# Altium schematic sheet CompoundPeripheral.SchDoc: Compound Peripheral
size A4; DrawnBy: J.F.B.; Revision: 1; SheetNumber: 1; SheetTotal: 1
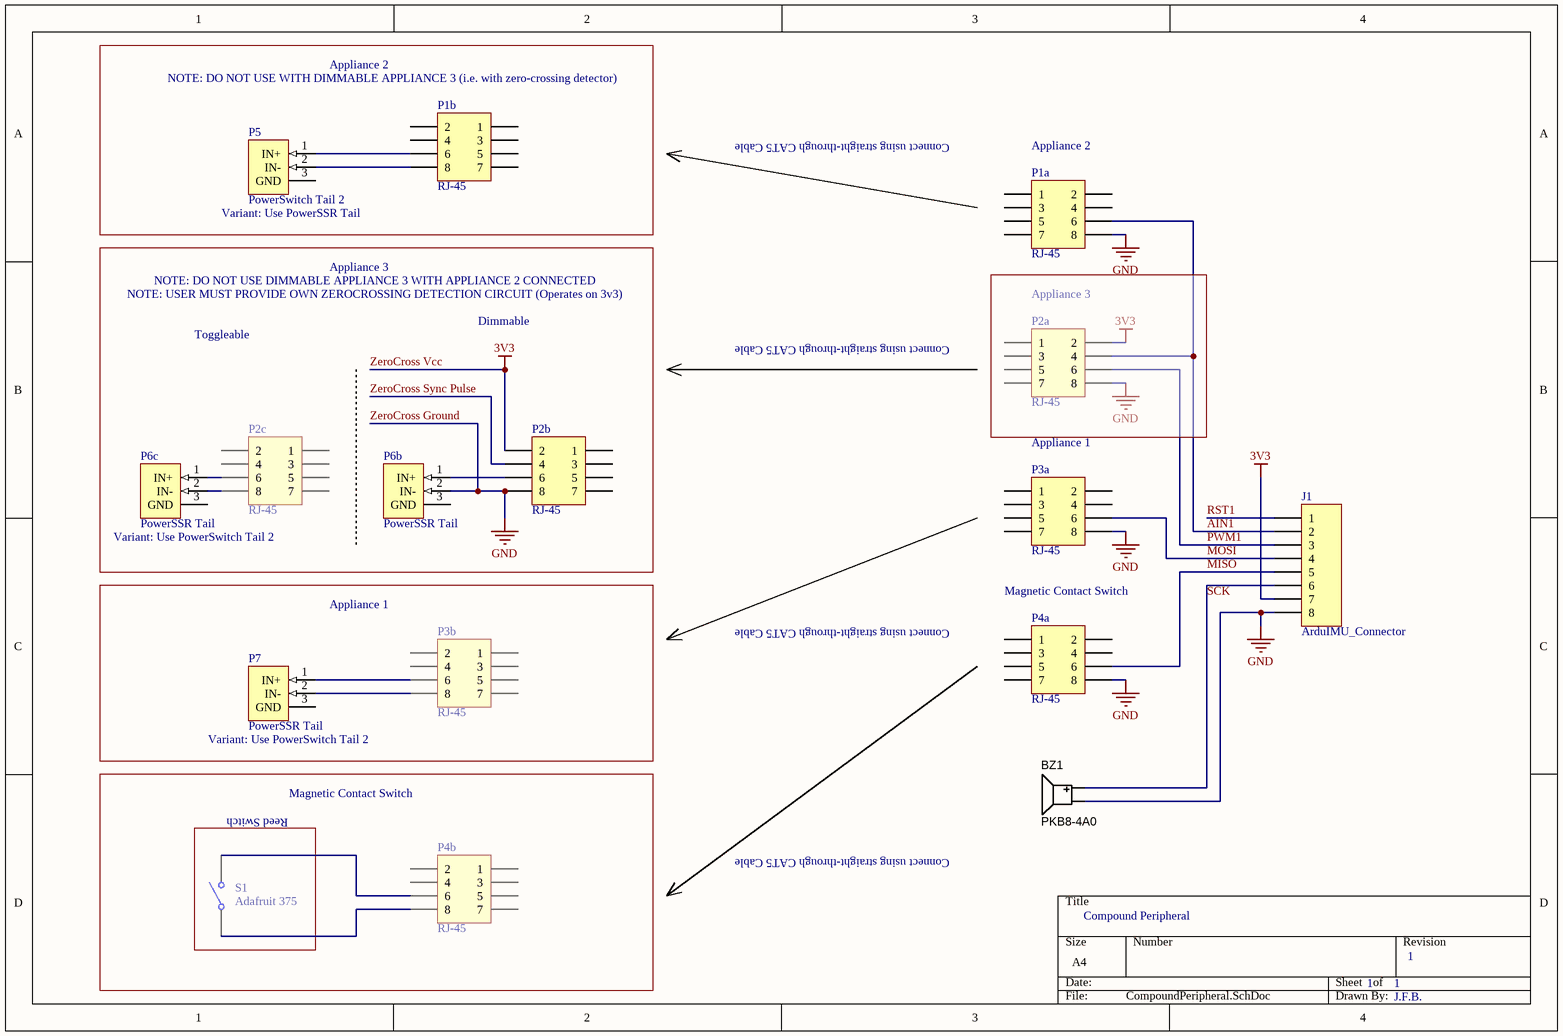
[diagram p0: CompoundPeripheral.SchDoc]

## Parts
BZ1  PKB8-4A0  [BUZZER_12.0X8.5MM]
J1  ArduIMU_Connector  [HDR1X8]
P1a  RJ-45  [HDR2X4]
P1b  RJ-45  [HDR2X4]
P2a  RJ-45  [HDR2X4]
P2b  RJ-45  [HDR2X4]
P2c  RJ-45  [HDR2X4]
P3a  RJ-45  [HDR2X4]
P3b  RJ-45  [HDR2X4]
P4a  RJ-45  [HDR2X4]
P4b  RJ-45  [HDR2X4]
P5  PowerSwitch Tail 2
P6b  PowerSSR Tail
P6c  PowerSSR Tail
P7  PowerSSR Tail
S1  Adafruit 375  [SPST-2]

## Blocks framed on the sheet
Appliance 3: P2a
Magnetic Contact Switch: P4b
Reed Switch: S1

## Nets
ZeroCross Ground: BZ1.2(Negative) J1.8 P1a.8 P2a.8 P2b.8 P3a.8 P4a.8 P6b.2(IN-)  [also labelled GND]
ZeroCross Vcc: J1.7 P2a.2 P2b.2  [also labelled 3V3]
AIN1: J1.2 P1a.6 P2a.4
MISO: J1.5 P4a.6
MOSI: J1.4 P3a.6
PWM1: J1.3 P2a.6
RST1: J1.1
SCK: BZ1.1(Positive) J1.6
ZeroCross Sync Pulse: P2b.4
NetP1b_6: P1b.6 P5.1(IN+)
NetP1b_8: P1b.8 P5.2(IN-)
NetP2b_6: P2b.6 P6b.1(IN+)
NetP2c_6: P2c.6 P6c.1(IN+)
NetP2c_8: P2c.8 P6c.2(IN-)
NetP3b_6: P3b.6 P7.1(IN+)
NetP3b_8: P3b.8 P7.2(IN-)
NetP4b_6: P4b.6 S1.2(NO)
NetP4b_8: P4b.8 S1.1(COMMON)

Not connected (* = marked no-connect by the designer): P1a 1 2 3 4 5 7; P1b 1 2 3 4 5 7; P2a 1 3 5 7; P2b 1 3 5 7; P2c 1 2 3 4 5 7; P3a 1 2 3 4 5 7; P3b 1 2 3 4 5 7; P4a 1 2 3 4 5 7; P4b 1 2 3 4 5 7; P5 3(GND); P6b 3(GND); P6c 3(GND); P7 3(GND)

## Notes on the sheet
- (near P1b) NOTE: DO NOT USE WITH DIMMABLE APPLIANCE 3 (i.e. with zero-crossing detector)
- Appliance 2
- Connect using straight-through CAT5 Cable
- (near P1a) Appliance 2
- (near P5) Variant: Use PowerSSR Tail
- NOTE: USER MUST PROVIDE OWN ZEROCROSSING DETECTION CIRCUIT (Operates on 3v3)
- NOTE: DO NOT USE DIMMABLE APPLIANCE 3 WITH APPLIANCE 2 CONNECTED
- Appliance 3
- Toggleable
- Dimmable
- Appliance 1
- Variant: Use PowerSwitch Tail 2
- Magnetic Contact Switch
- (near P7) Variant: Use PowerSwitch Tail 2

## Library data of the parts
BZ1 = BZ_12x8.5x6.5_2kHz: Speaker, Magnetic Transducer; Manufacturer 1: CUI Inc; Ratings: 2048 ±200 Hz; SCDType: source; Package / Case: 6.5mm pitch; Material: Noryl SE1-J; Supplier 1: Digi-Key; Supplier Part Number 1: 102-1152-ND; Manufacturer Part Number 1: PKB8-4A0
J1 = Header 8: Header, 8-Pin; LatestRevisionDate: 17-Jul-2002; LatestRevisionNote: Re-released for DXP Platform.; Publisher: Altium Limited
P1a P1b P2a P2b P2c P3a P3b P4a P4b = Header 4X2: Header, 4-Pin, Dual row; LatestRevisionDate: 17-Jul-2002; LatestRevisionNote: Re-released for DXP Platform.; Publisher: Altium Limited
S1 = SW-SPST: Single-Pole, Single-Throw Switch; Published: 24-Mar-1999; LatestRevisionDate: 17-Jul-2002; LatestRevisionNote: Re-released for DXP Platform.; PackageReference: SPST-2; Publisher: Altium Limited; PackageDescription: Switch; 2 Leads